# EAGLE design MSGEQ7_8x8matrix-r1 (EAGLE 9.6.2)
REV: 0.1
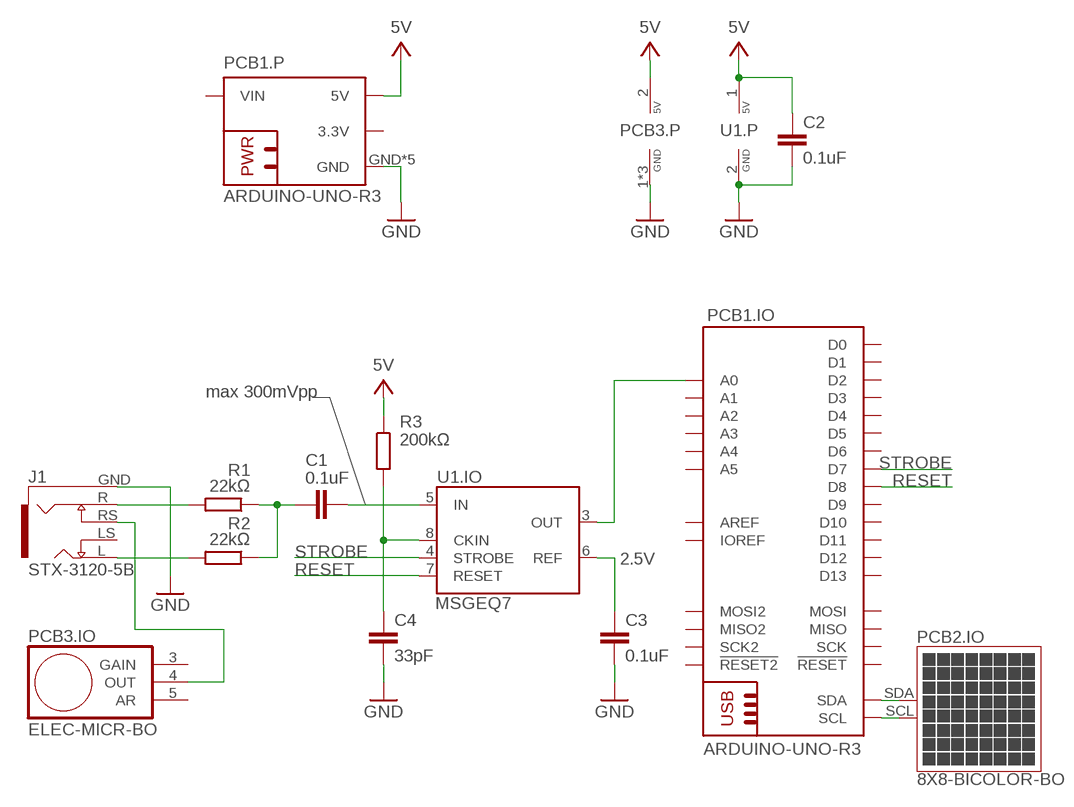
[diagram p0: schematic, sheet 1]

## Parts
C1  0.1uF  C-EUC0805K  [C0805K]
C2  0.1uF  C-EUC0805K  [C0805K]
C3  0.1uF  C-EUC0805K  [C0805K]
C4  33pF  C-EUC0805K  [C0805K]
J1  STX-3120-5B  [STX-3120-5B]
PCB1  ARDUINO-UNO-R3  [ARDUINO-UNO--R3]
PCB2  ADAFRUIT-8X8LED-BO  [ADAFRUIT-8X8LED]
PCB3  ELEC-MICR-BO  [ELEC_MICR_BREAKOUT]
R1  22kΩ  R-EU_R0805  [R0805]
R2  22kΩ  R-EU_R0805  [R0805]
R3  200kΩ  R-EU_R0805  [R0805]
U1  MSGEQ7DIL  [DIL-08]

## Nets
2.5V: C3.1 U1.6(.IO:REF)
5V: C2.1 PCB1.5V(.P:5V) PCB1.5V@1(.P:5V) PCB1.5V@2(.P:5V) PCB3.2(.P:5V) R3.1 U1.1(.P:5V)
GND: C2.2 C3.2 C4.2 J1.GND PCB1.GND(.P:GND) PCB1.GND@1(.P:GND) PCB1.GND@2(.P:GND) PCB1.GND@3(.P:GND) PCB1.GND@4(.P:GND) PCB3.1(.P:GND) PCB3.P$1(.P:GND) PCB3.P$2(.P:GND) U1.2(.P:GND)
N$1: J1.R R1.2
N$2: C1.1 R1.1 R2.1
N$3: C1.2 U1.5(.IO:IN)
N$4: J1.L R2.2
N$5: PCB1.SDA(.IO:SDA) PCB2.SDA(.IO:SDA)
N$6: C4.1 R3.2 U1.8(.IO:CKIN)
N$7: PCB1.A0(.IO:A0) U1.3(.IO:OUT)
N$9: J1.RS PCB3.4(.IO:OUT)
N$10: PCB1.SCL(.IO:SCL) PCB2.SCL(.IO:SCL)
RESET: PCB1.D8(.IO:D8) U1.7(.IO:RESET)
STROBE: PCB1.D7(.IO:D7) U1.4(.IO:STROBE)
Unconnected: J1.LS PCB1.3.3V(.P:3.3V) PCB1.!RESET2!(.IO:!RESET2!) PCB1.!RESET!(.IO:!RESET!) PCB1.!RESET!@1(.IO:!RESET!) PCB1.A1(.IO:A1) PCB1.A2(.IO:A2) PCB1.A3(.IO:A3) PCB1.A4(.IO:A4) PCB1.A5(.IO:A5) PCB1.AREF(.IO:AREF) PCB1.D0(.IO:D0) PCB1.D1(.IO:D1) PCB1.D2(.IO:D2) PCB1.D3(.IO:D3) PCB1.D4(.IO:D4) PCB1.D5(.IO:D5) PCB1.D6(.IO:D6) PCB1.D9(.IO:D9) PCB1.D10(.IO:D10) PCB1.D11(.IO:D11) PCB1.D12(.IO:D12) PCB1.D13(.IO:D13) PCB1.IOREF(.IO:IOREF) PCB1.MISO2(.IO:MISO2) PCB1.MISO(.IO:MISO) PCB1.MOSI2(.IO:MOSI2) PCB1.MOSI(.IO:MOSI) PCB1.SCK2(.IO:SCK2) PCB1.SCK(.IO:SCK) PCB1.VIN(.P:VIN) PCB2.GND(.P:GND) PCB2.VCC(.P:5V) PCB3.3(.IO:GAIN) PCB3.5(.IO:AR)

## Notes on the sheet
- max 300mVpp

## Library data of the parts
C1-C4 = rcl:C-EU: CAPACITOR, European symbol; MANF: Murata Electronics; MANF#: GJ821BR61E106KE11L; MOUSER#: 81-GJ821BR61E106KE1L; SPICEPREFIX: C
J1 = Coert-Vonk:STX-3120-5B: Conn 3.5MM Stereo Jack F 5 POS Solder RA Thru-Hole 5 Terminal 1 Port; DESCRIPTION: 3.50mm (0.141, 1/8, Mini Plug) - Headphone Phone Jack Stereo (3 Conductor, TRS) Connector Solder; DIGI-KEY_PART_NUMBER: SC1459-ND; MF: Switchcraft; MP: 35RAPC4BHN2; PACKAGE: None; PURCHASE-URL: https://pricing.snapeda.com/search/part/35RAPC4BHN2/?ref=eda
PCB1 = Coert-Vonk:ARDUINO-UNO-R3: Footprint of Arduino R3 with two SPI headers Arduino Uno R3 Compatible Footprint. Matches PCB size of the original board.
PCB2 = Coert-Vonk:ADAFRUIT-8X8LED-BO
PCB3 = Coert-Vonk:ELEC-MICR-BO: Footprint of Adafruit AGC Electret Microphone Amplifier - MAX9814 Link to part <https://learn.adafruit.com/adafruit-agc-electret-microphone-amplifier-max9814/overview>
R1-R3 = rcl:R-EU_: RESISTOR, European symbol; MANF: Bourns; MANF#: CRM0805-JW-1R5ELF; MOUSER#: 652-CRM0805JW1R5ELF; SPICEPREFIX: R
U1 = Coert-Vonk:MSGEQ7: 7-band graphic equalizer

## Board
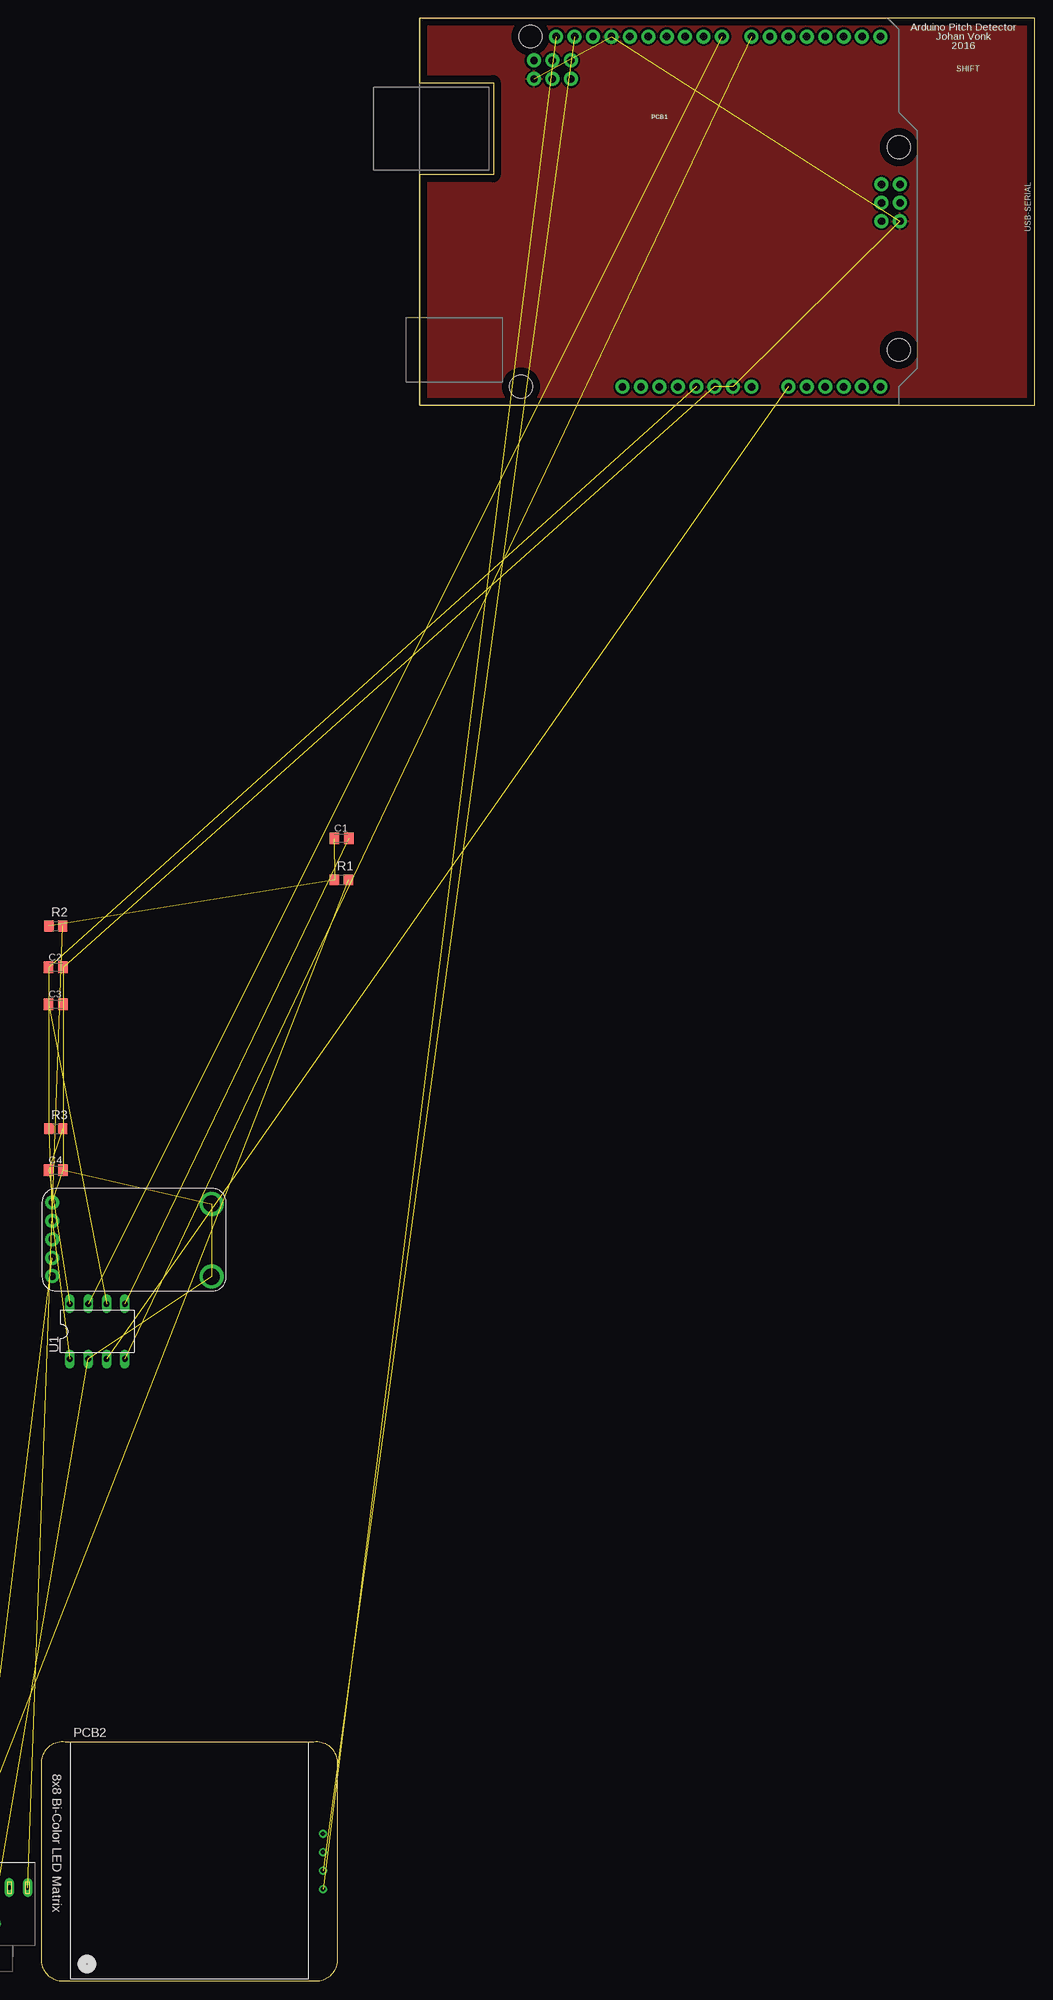
[diagram p1: board, top side]
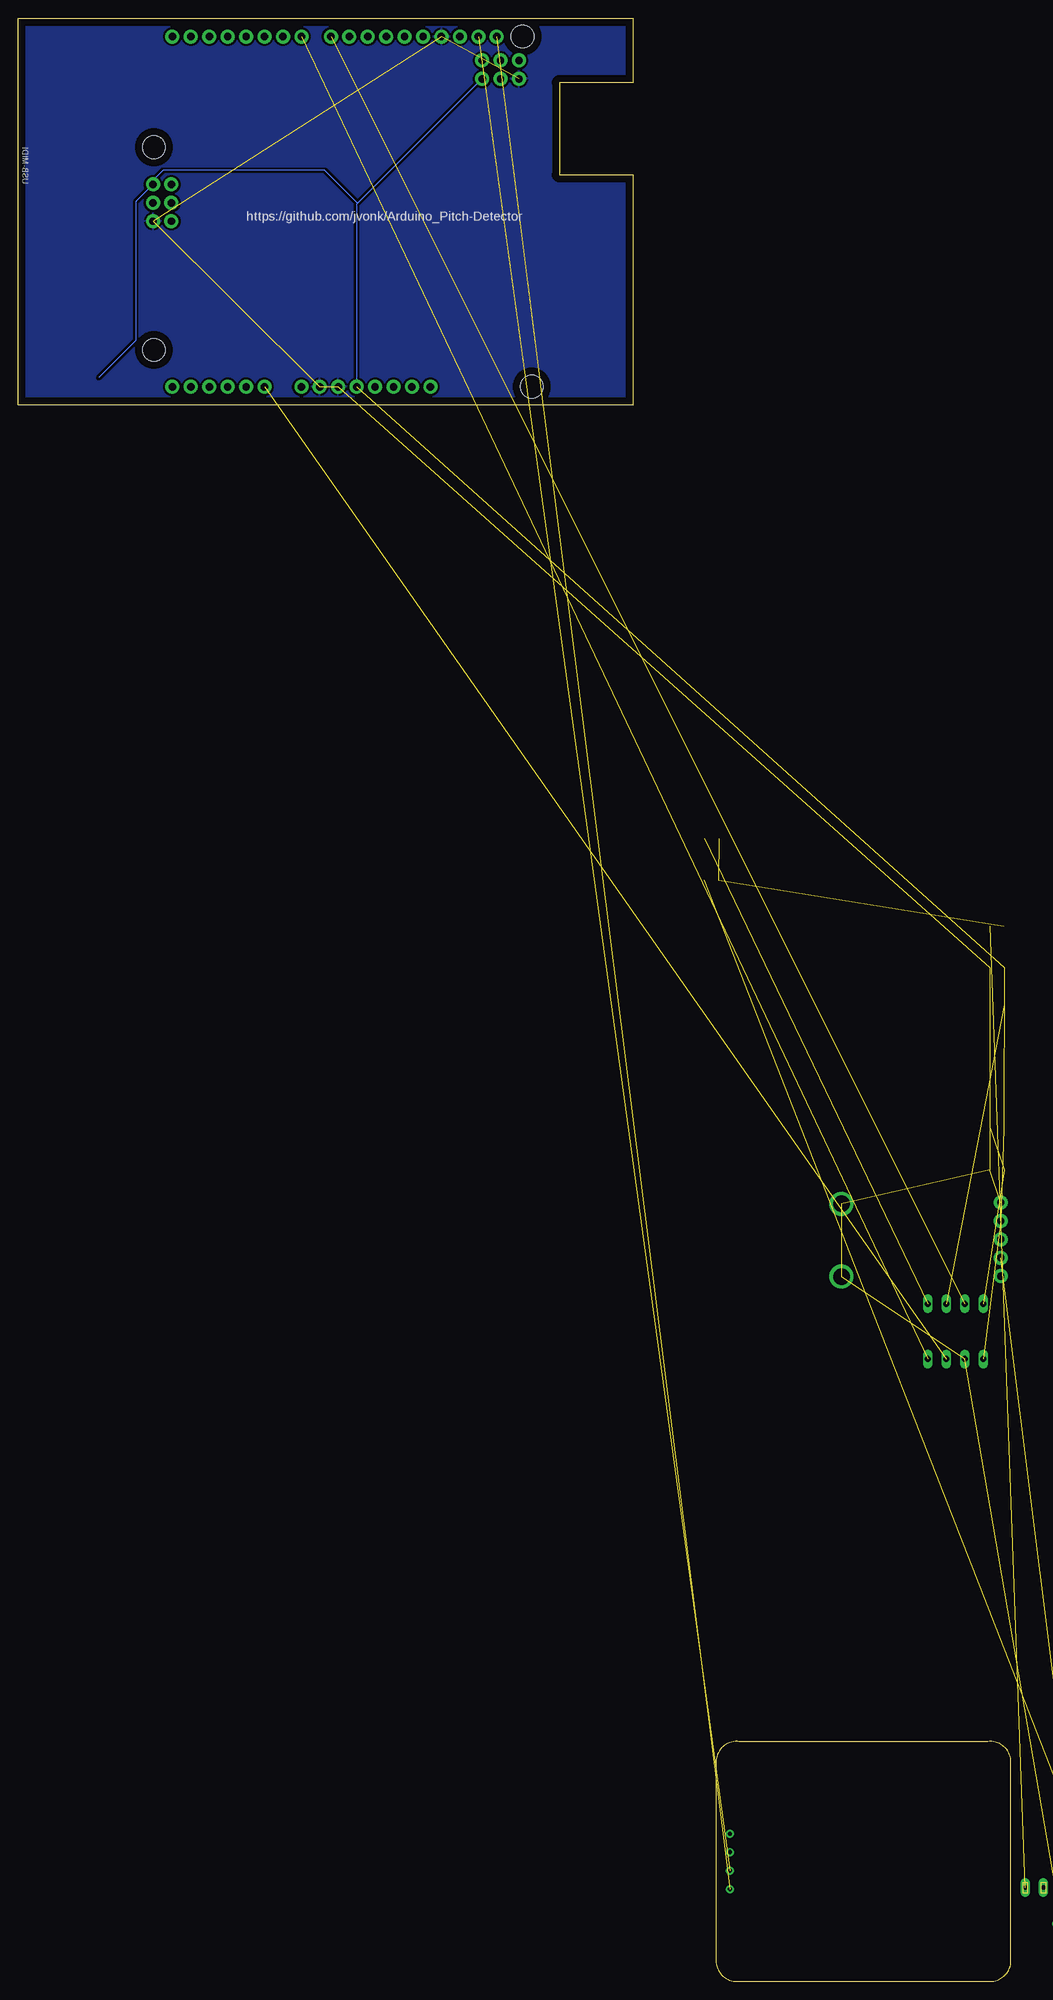
[diagram p2: board, bottom side, seen from below]

Size 84.76 x 53.33 mm. Coordinates in mm from the lower left corner, seen from the top.
Outline: 0,0 84.76,0 84.76,53.33 0,53.33 0,44.45 10.16,44.45 10.16,31.75 0,31.75 0,0
Copper layers (1*16): Top 0.035mm / dielectric 1.5mm / Bottom 0.035mm
Design rules "default": minimum track width 6mil, minimum drill 0.35mm, track to track 6mil, track to pad 6mil, pad to pad 6mil, via to via 6mil, smd to smd 6mil, copper to edge 40mil, drill to drill 6mil, minimum pad ring 10mil, minimum via ring 8mil, stop-mask expansion 4mil, vias tented up to drill 0mil, thermal gap 10mil

### Footprints (pad centres in the part's own frame; a part is rotated, then mirrored left to right if it is on the bottom)
C0805K = smd 1.3 x 1.6: 1 -1,0; 2 1,0
STX-3120-5B = drill 0.6 pad 1.3 long: GND 0,-1; L 5,4; LS 2.5,4; R -5,4; RS -2.5,4 | hole 1.2: 0,4
ARDUINO-UNO--R3 = drill 1.016 pad 1.93: 3.3V 2.54,-24.13; 5V 5.08,-24.13; 5V@1 33.16,3.76; 5V@2 -12.204,18.289; !RESET2! -17.284,20.829; !RESET! 0,-24.13; !RESET!@1 30.62,-1.32; A0 17.78,-24.13; A1 20.32,-24.13; A2 22.86,-24.13; A3 25.4,-24.13; A4 27.94,-24.13; A5 30.48,-24.13; AREF -9.144,24.13; D0 30.48,24.13; D1 27.94,24.13; D2 25.4,24.13; D3 22.86,24.13; D4 20.32,24.13; D5 17.78,24.13; D6 15.24,24.13; D7 12.7,24.13; D8 8.636,24.13; D9 6.096,24.13; D10 3.556,24.13; D11 1.016,24.13; D12 -1.524,24.13; D13 -4.064,24.13; GND 7.62,-24.13; GND@1 10.16,-24.13; GND@2 -6.604,24.13; GND@3 33.16,-1.32; GND@4 -17.284,18.289; IOREF -2.54,-24.13; MISO 30.62,3.76; MISO2 -12.204,20.829; MOSI 33.16,1.22; MOSI2 -14.744,18.289; NC -5.08,-24.13; SCK 30.62,1.22; SCK2 -14.744,20.829; SCL -14.224,24.13; SDA -11.684,24.13; VIN 12.7,-24.13 | hole 3.175: -17.78,24.13; 33.02,8.89; 33.02,-19.05; -19.05,-24.13
ADAFRUIT-8X8LED = drill 0.6: GND 24.13,-3.81; SCL 24.13,-8.89; SDA 24.13,-6.35; VCC 24.13,-1.27
ELEC_MICR_BREAKOUT = drill 1 pad 1.93: 1 -11.303,5.715; 2 -11.303,3.175; 3 -11.303,0.635; 4 -11.303,-1.905; 5 -11.303,-4.445 | drill 2.28: P$1 10.668,5.524; P$2 10.668,-4.508
R0805 = smd 1.3 x 1.5: 1 -0.95,0; 2 0.95,0
DIL-08 = drill 0.813 long: 1 -3.81,-3.81; 2 -1.27,-3.81; 3 1.27,-3.81; 4 3.81,-3.81; 5 3.81,3.81; 6 1.27,3.81; 7 -1.27,3.81; 8 -3.81,3.81

### Placement (x,y rotation side)
C1  -10.79,-59.69 0 top  (outside the outline)
C2  -50.16,-77.47 0 top  (outside the outline)
C3  -50.16,-82.55 0 top  (outside the outline)
C4  -50.16,-105.41 0 top  (outside the outline)
J1  -59.05,-208.28 0 top  (outside the outline)
PCB1  33.02,26.67 0 top
PCB2  -37.47,-195.58 0 top  (outside the outline)
PCB3  -39.37,-115.57 0 top  (outside the outline)
R1  -10.79,-65.41 0 top  (outside the outline)
R2  -50.16,-71.75 0 top  (outside the outline)
R3  -50.16,-99.69 0 top  (outside the outline)
U1  -44.45,-127.64 0 top  (outside the outline)

### Tracks (layer width: path | path; a pad name or v marks a point on that pad's centre or on a via)
2.5V  (1 unrouted)
5V  (4 unrouted)
  Bottom 0.152: 73.66,3.81 68.58,8.89 68.58,28.03 PCB1.5V@1 66.18,30.98 64.77,32.38 42.55,32.38 37.97,27.81 | PCB1.5V@2 37.97,27.81 | 37.97,27.81 38.1,27.67 PCB1.5V
GND  (12 unrouted)
  pour Bottom (isolate 0.305): 0,44.45 0,53.34 84.71,53.34 84.71,0 0,0 0,31.75 10.16,31.75 10.16,44.45
  pour Top (isolate 0.305): 0,44.45 0,53.34 84.71,53.34 84.71,0 0,0 0,31.75 10.16,31.75 10.16,44.45
N$1  (1 unrouted)
N$2  (2 unrouted)
N$3  (1 unrouted)
N$4  (1 unrouted)
N$5  (1 unrouted)
N$6  (2 unrouted)
N$7  (1 unrouted)
N$9  (1 unrouted)
N$10  (1 unrouted)
RESET  (1 unrouted)
STROBE  (1 unrouted)

### Text on the board
tPlace: Arduino Pitch Detector | Johan Vonk | 2016 | SHIFT | USB-SERIAL
bPlace: USB-MIDI | https://github.com/jvonk/Arduino_Pitch-Detector